# EAGLE design Enclosure 100x68 SP (EAGLE 9.6.2)
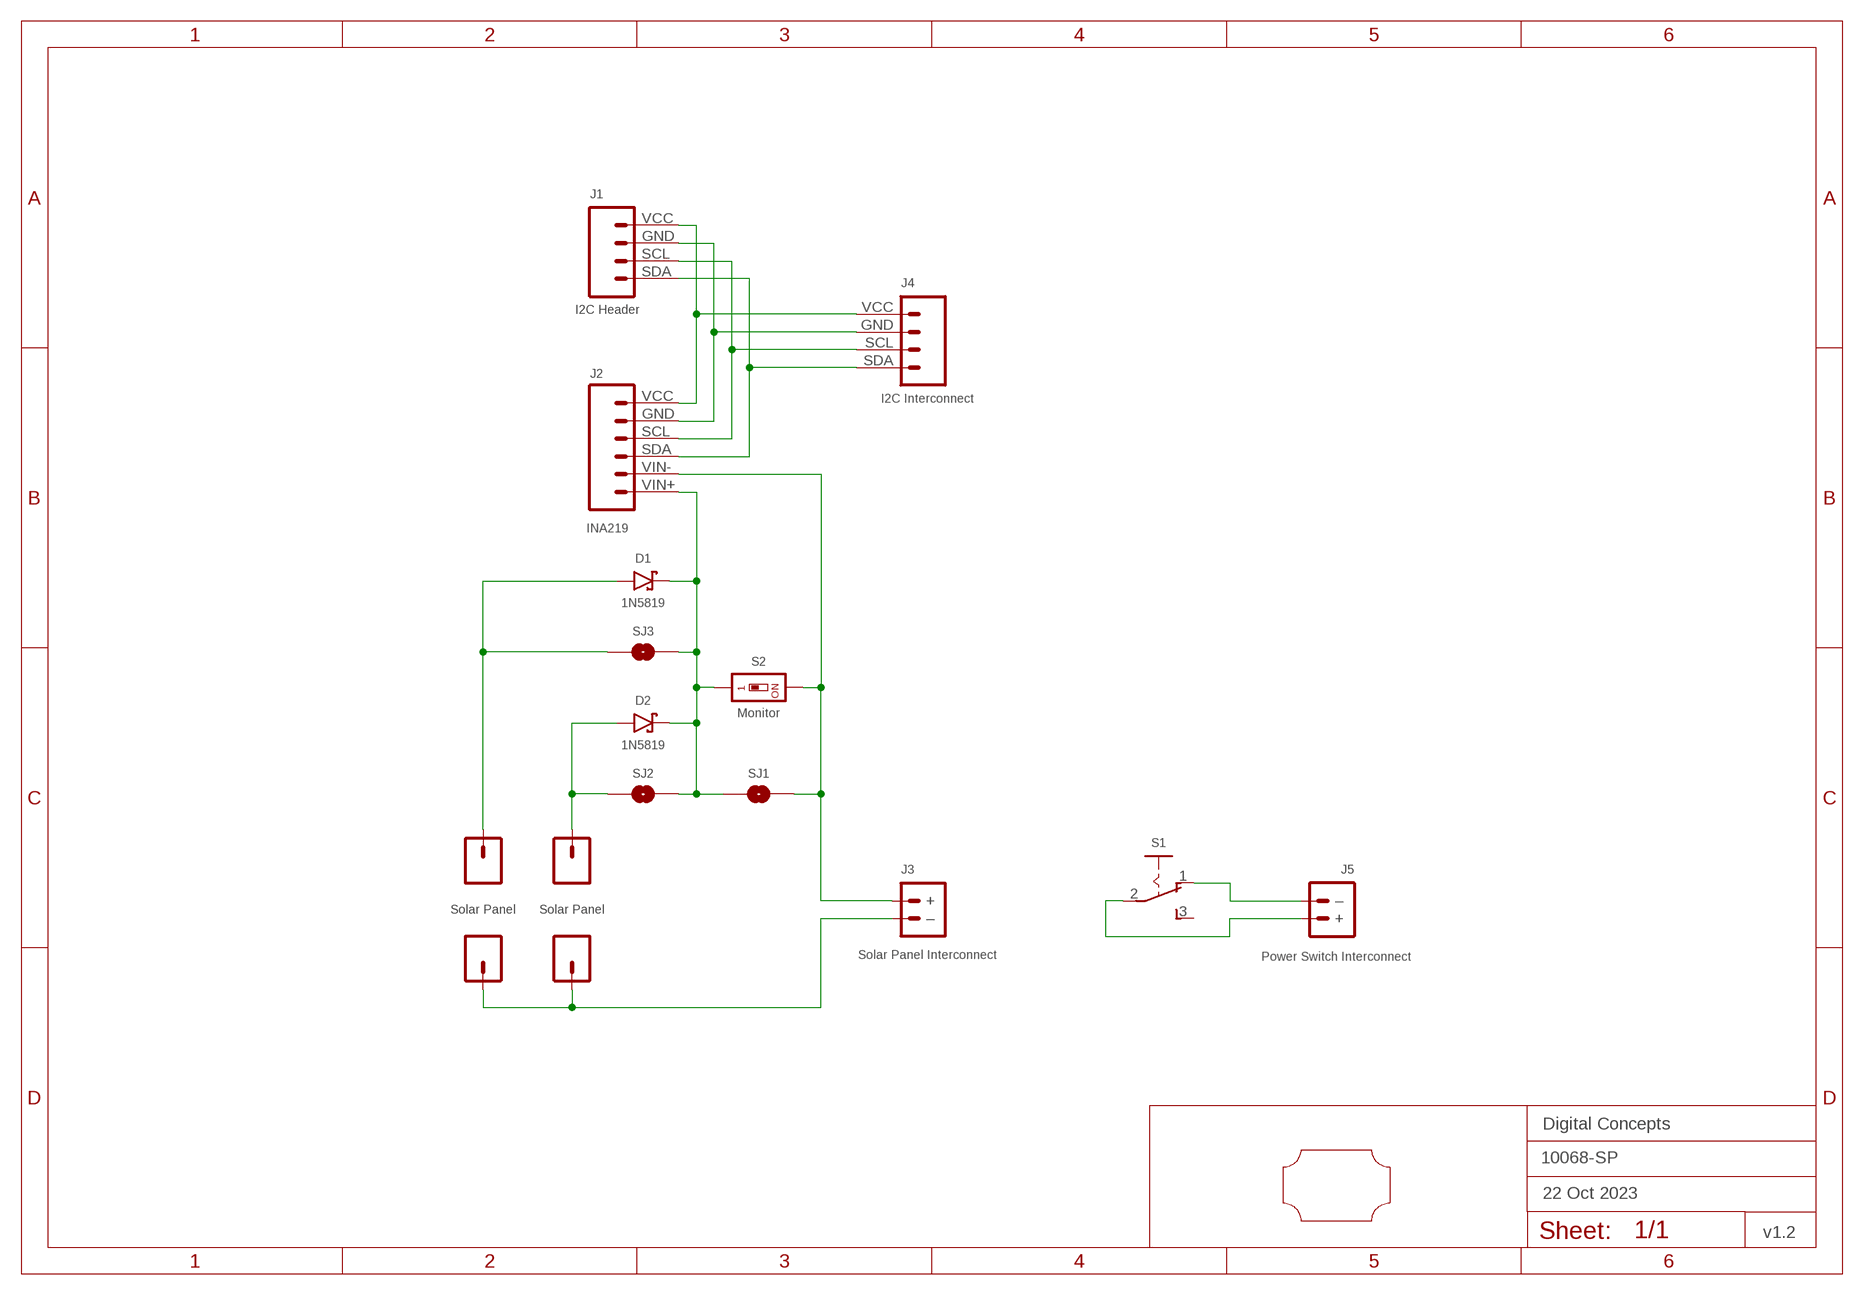
[diagram p0: schematic, sheet 1]
FRAME2 (FRAME-A4L-LOC): DATE: 22 Oct 2023; OWNER: Digital Concepts; TITLE: 10068-SP; VERSION: v1.2

## Parts
+  Solar Panel  PAD-SMD-GENERIC-SQUARE  [PAD-SMD-GENERIC]
+1  Solar Panel  PAD-SMD-GENERIC-SQUARE  [PAD-SMD-GENERIC]
-  Solar Panel  PAD-SMD-GENERIC-SQUARE  [PAD-SMD-GENERIC]
-1  Solar Panel  PAD-SMD-GENERIC-SQUARE  [PAD-SMD-GENERIC]
D1  1N5819  DIODE-SCHOTTKY-1N5819  [SOD-123]
D2  1N5819  DIODE-SCHOTTKY-1N5819  [SOD-123]
J1  I2C Header  HEADER-1X4-I2C  [CONN_04-I2C]
J2  INA219  INA219-I2C-MODULE  [CONN_06-INA219]
J3  Solar Panel Interconnect  JST-PH2.0-2-HORIZONTALJST-PTH-2  [JST-PH2.0-2-HORIZONTAL]
J4  I2C Interconnect  JST-PH2.0-4-I2C-HORIZONTAL  [JST-PH2.0-4-HORIZONTAL]
J5  Power Switch Interconnect  JST-PH2.0-2-HORIZONTALJST-PTH-2  [JST-PH2.0-2-HORIZONTAL]
S1  SWITCH-SLIDE-SPDT  [SWITCH-SPDT-PTH]
S2  Monitor  SWITCH-DIP-SWS001  [SMD-001]
SJ1  SJ  [SJ]
SJ2  SJ  [SJ]
SJ3  SJ  [SJ]
U$1  PROTO-34X22-SP  [PROTO-34X22-SP]

## Nets
GND: J1.GND J2.GND J4.GND
N$1: J1.SDA J2.SDA J4.SDA
N$2: J1.SCL J2.SCL J4.SCL
N$3: +1.P$1 D1.A SJ3.1
N$4: J2.VIN- J3.1(+) S2.2 SJ1.2
N$5: D1.C D2.C J2.VIN+ S2.1 SJ1.1 SJ2.2 SJ3.2
N$6: J5.1(+) S1.2(P)
N$7: -1.P$1 -.P$1 J3.2(–)
N$8: +.P$1 D2.A SJ2.1
N$9: J5.2(–) S1.1(O)
VCC: J1.VCC J2.VCC J4.VCC
Unconnected: S1.3(S)

## Library data of the parts
+ +1 - -1 = digitalconcepts:PAD-SMD-GENERIC-SQUARE: SMD Pad—Square
D1 D2 = digitalconcepts:DIODE-SCHOTTKY-1N5819: 1N5819 Schottky Diode SOD-123
J1 = digitalconcepts:HEADER-1X4-I2C: I2C Interface [Pin 1 Vcc] 4-Pin Header
J2 = digitalconcepts:INA219-I2C-MODULE: INA219 I2C Module
J3 J5 = digitalconcepts:JST-PH2.0-2-HORIZONTAL: PH2.0 2P Right Angle PCB Connector; PROD_ID: CONN-09863; SKU: PRT-09914
J4 = digitalconcepts:JST-PH2.0-4-I2C-HORIZONTAL: PH2.0 4P I2C Horizontal Connector
S1 = digitalconcepts:SWITCH-SLIDE-SPDT: Mini Sliding Switch SPDT
S2 = digitalconcepts:SWITCH-DIP-SWS001: SMD Dip Switch 1 pol.
SJ1-SJ3 = digitalconcepts:SJ: Solder Jumper
U$1 = digitalconcepts:PROTO-34X22-SP: 34 x 22 Prototyping board to fit an 100 x 68 enclosure—Solar panel support

## Board
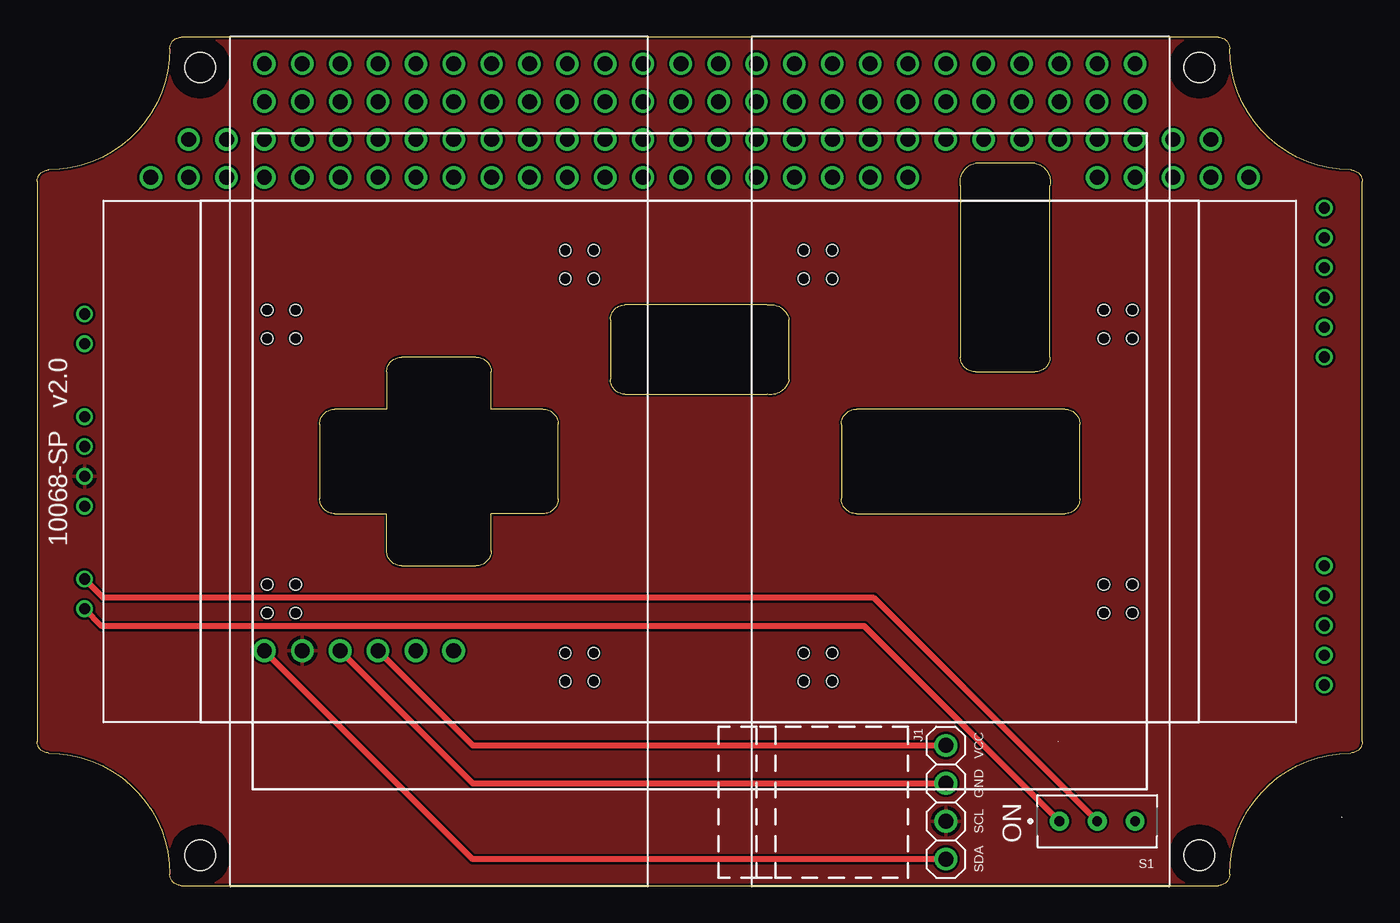
[diagram p1: board, top side]
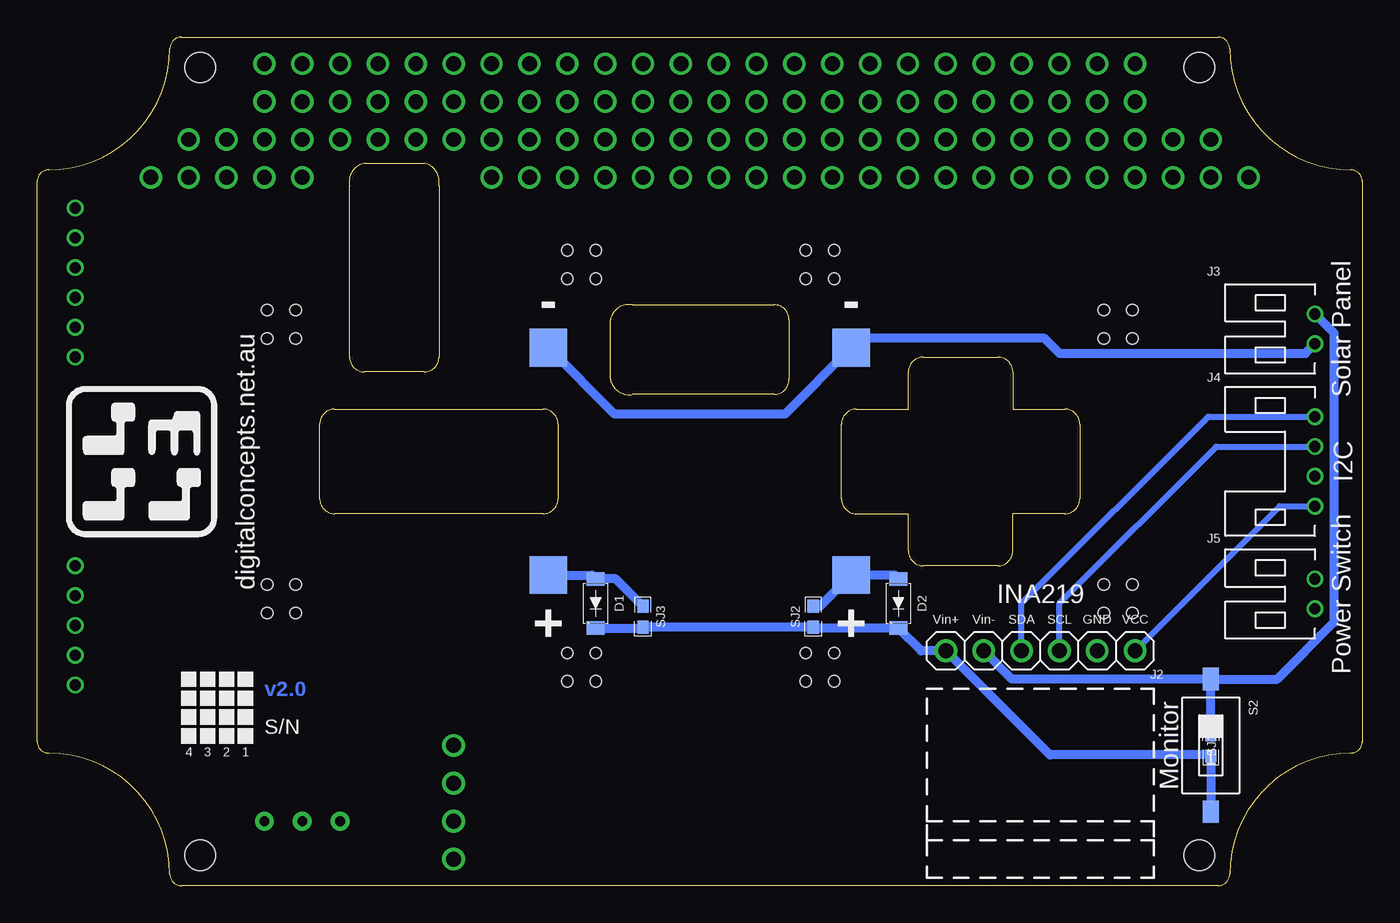
[diagram p2: board, bottom side, seen from below]

Size 88.9 x 56.9 mm. Coordinates in mm from the lower left corner, seen from the top.
Copper layers (1*16): Top 0.035mm / dielectric 1.5mm / Bottom 0.035mm
Design rules "default *": minimum track width 6mil, minimum drill 0.35mm, track to track 6mil, track to pad 6mil, pad to pad 6mil, via to via 6mil, smd to smd 6mil, copper to edge 6mil, drill to drill 6mil, minimum pad ring 1mil, minimum via ring 8mil, stop-mask expansion 4mil, vias tented up to drill 0mil, thermal gap 10mil

### Footprints (pad centres in the part's own frame; a part is rotated, then mirrored left to right if it is on the bottom)
PAD-SMD-GENERIC = smd 2.54 x 2.54: P$1 0,0
SOD-123 = smd 0.91 x 1.22: A -1.65,0; C 1.65,0
CONN_04-I2C = drill 1 pad 1.524: GND 2.54,0; SCL 5.08,0; SDA 7.62,0; VCC 0,0
CONN_06-INA219 = drill 1 pad 1.524: GND 2.54,0; SCL 5.08,0; SDA 7.62,0; VCC 0,0; VIN+ 12.7,0; VIN- 10.16,0
JST-PH2.0-2-HORIZONTAL = drill 0.75: 1 1,0; 2 -1,0
JST-PH2.0-4-HORIZONTAL = drill 0.75: GND -1,0; SCL 1,0; SDA 3,0; VCC -3,0
SWITCH-SPDT-PTH = drill 0.65 pad 1.27: 1 -2.54,0; 2 0,0; 3 2.54,0
SMD-001 = smd 1.1 x 1.5: 1 0,-4.45; 2 0,4.45
SJ = smd 0.864 x 0.762: 1 -0.711,0; 2 0.711,0
PROTO-34X22-SP = drill 0.75: P01-05 41.91,17; P01-06 41.91,15; P01-07 41.91,13; P01-08 41.91,11; P01-09 41.91,9; P01-10 41.91,7; P01-17 41.91,-7; P01-18 41.91,-9; P01-19 41.91,-11; P01-20 41.91,-13; P01-21 41.91,-15 | drill 1: P03-04 36.83,19.05; P04-03 34.29,21.59; P04-04 34.29,19.05; P05-03 31.75,21.59; P05-04 31.75,19.05; P06-01 29.21,26.67; P06-02 29.21,24.13; P06-03 29.21,21.59; P06-04 29.21,19.05; P07-01 26.67,26.67; P07-02 26.67,24.13; P07-03 26.67,21.59; P07-04 26.67,19.05; P08-01 24.13,26.67; P08-02 24.13,24.13; P08-03 24.13,21.59; P09-01 21.59,26.67; P09-02 21.59,24.13; P09-03 21.59,21.59; P10-01 19.05,26.67; P10-02 19.05,24.13; P10-03 19.05,21.59; P11-01 16.51,26.67; P11-02 16.51,24.13; P11-03 16.51,21.59; P12-01 13.97,26.67; P12-02 13.97,24.13; P12-03 13.97,21.59; P12-04 13.97,19.05; P13-01 11.43,26.67; P13-02 11.43,24.13; P13-03 11.43,21.59; P13-04 11.43,19.05; P14-01 8.89,26.67; P14-02 8.89,24.13; P14-03 8.89,21.59; P14-04 8.89,19.05; P15-01 6.35,26.67; P15-02 6.35,24.13; P15-03 6.35,21.59; P15-04 6.35,19.05; P16-01 3.81,26.67; P16-02 3.81,24.13; P16-03 3.81,21.59; P16-04 3.81,19.05; P17-01 1.27,26.67; P17-02 1.27,24.13; P17-03 1.27,21.59; P17-04 1.27,19.05; P18-01 -1.27,26.67; P18-02 -1.27,24.13; P18-03 -1.27,21.59; P18-04 -1.27,19.05; P19-01 -3.81,26.67; P19-02 -3.81,24.13; P19-03 -3.81,21.59; P19-04 -3.81,19.05; P20-01 -6.35,26.67; P20-02 -6.35,24.13; P20-03 -6.35,21.59; P20-04 -6.35,19.05; P21-01 -8.89,26.67; P21-02 -8.89,24.13; P21-03 -8.89,21.59; P21-04 -8.89,19.05; P22-01 -11.43,26.67; P22-02 -11.43,24.13; P22-03 -11.43,21.59; P22-04 -11.43,19.05; P23-01 -13.97,26.67; P23-02 -13.97,24.13; P23-03 -13.97,21.59; P23-04 -13.97,19.05; P24-01 -16.51,26.67; P24-02 -16.51,24.13; P24-03 -16.51,21.59; P24-04 -16.51,19.05; P25-01 -19.05,26.67; P25-02 -19.05,24.13; P25-03 -19.05,21.59; P25-04 -19.05,19.05; P26-01 -21.59,26.67; P26-02 -21.59,24.13; P26-03 -21.59,21.59; P26-04 -21.59,19.05; P27-01 -24.13,26.67; P27-02 -24.13,24.13; P27-03 -24.13,21.59; P27-04 -24.13,19.05; P28-01 -26.67,26.67; P28-02 -26.67,24.13; P28-03 -26.67,21.59; P28-04 -26.67,19.05; P29-01 -29.21,26.67; P29-02 -29.21,24.13; P29-03 -29.21,21.59; P29-04 -29.21,19.05; P30-03 -31.75,21.59; P30-04 -31.75,19.05; P31-03 -34.29,21.59; P31-04 -34.29,19.05; P32-04 -36.83,19.05 | hole 2.032: 33.528,-26.416; -33.528,-26.416; -33.528,26.416; 33.528,26.416 | hole 0.75: 29.02,-10.16; 27.115,-10.16; 27.115,-8.255; 29.02,-8.255; 29.02,8.255; 27.115,8.255; 27.115,10.16; 29.02,10.16; -27.115,8.255; -29.02,8.255; -29.02,10.16; -27.115,10.16; -27.115,-10.16; -29.02,-10.16; -29.02,-8.255; -27.115,-8.255; -7.115,12.255; -9.02,12.255; -9.02,14.16; -7.115,14.16; 8.885,12.255; 6.98,12.255; 6.98,14.16; 8.885,14.16; 8.885,-14.745; 6.98,-14.745; 6.98,-12.84; 8.885,-12.84; -7.115,-14.745; -9.02,-14.745; -9.02,-12.84; -7.115,-12.84

### Placement (x,y rotation side)
+  34.29,20.83 180 bottom
+1  54.61,20.83 180 bottom
-  34.29,36.07 180 bottom
-1  54.61,36.07 180 bottom
D1  51.44,18.92 270 bottom
D2  31.12,18.92 270 bottom
J1  60.96,1.78 90 top
J2  15.24,15.75 180 bottom
J3  3.18,37.34 90 bottom
J4  3.18,28.45 90 bottom
J5  3.18,19.56 90 bottom
S1  71.12,4.32 0 top
S2  10.16,9.4 0 bottom
SJ1  10.16,9.4 90 bottom
SJ2  36.83,18.03 270 bottom
SJ3  48.26,18.03 270 bottom
U$1  44.45,28.45 0 top

### Tracks (layer width: path | path; a pad name or v marks a point on that pad's centre or on a via)
$X0
  cutout Bottom: 77.98,0 arc180 77.98,4.06 arc180
$X1
  cutout Bottom: 10.92,0 arc180 10.92,4.06 arc180
$X2
  cutout Bottom: 10.92,52.83 arc180 10.92,56.9 arc180
$X3
  cutout Bottom: 77.98,52.83 arc180 77.98,56.9 arc180
$X4
  cutout Top: 77.98,0 arc180 77.98,4.06 arc180
$X5
  cutout Top: 10.92,0 arc180 10.92,4.06 arc180
$X6
  cutout Top: 10.92,52.83 arc180 10.92,56.9 arc180
$X7
  cutout Top: 77.98,52.83 arc180 77.98,56.9 arc180
GND
  pour Top: 90.17,-1.4 -1.27,-1.4 -1.27,58.29 90.17,58.29
N$1
  Top 0.406: J2.SDA 29.21,9.4 J1.SDA
  Bottom 0.406: J2.SDA 22.86,18.92 10.34,31.45 J4.SDA
N$2
  Top 0.406: J1.SCL 29.21,6.86 J2.SCL
  Bottom 0.406: J2.SCL 20.32,18.92 9.8,29.45 J4.SCL
N$3
  Bottom 0.61: +1.P$1 51.69,20.83 D1.A 50.09,20.57 SJ3.1
N$4
  Bottom 0.61: J3.1 1.91,37.07 1.91,17.66 5.72,13.85 S2.2 | SJ1.2 S2.2 | S2.2 23.5,13.85 J2.VIN-
N$5
  Bottom 0.61: S2.1 SJ1.1 10.24,8.76 20.96,8.76 J2.VIN+ 29.59,15.75 D2.C 36.78,17.27 SJ2.2 SJ3.2 48.31,17.27 D1.C
N$6
  Top 0.406: S1.2 56.13,19.3 4.43,19.3 J5.1
N$7
  Bottom 0.61: J3.2 3.81,35.7 20.32,35.7 21.32,36.7 33.66,36.7 -.P$1 38.73,31.62 50.16,31.62 -1.P$1
N$8
  Bottom 0.61: D2.A 31.37,20.83 +.P$1 36.37,18.75 SJ2.1
N$9
  Top 0.406: S1.1 55.5,17.4 4.33,17.4 J5.2
VCC
  Top 0.406: J1.VCC 29.21,1.78 J2.VCC
  Bottom 0.406: J2.VCC 5.54,25.45 J4.VCC

### Text on the board
Bottom: v2.0
tPlace: 10068-SP v2.0 | VCC | GND | SCL | ON | SDA
bPlace: digitalconcepts.net.au | VCC | GND | SCL | SDA | Vin- | Vin+ | S/N | 1 | 2 | 3 | 4
bNames: - | Solar Panel | I2C | Power Switch | +